# Altium schematic sheet IC2.SchDoc
size A4; SheetNumber: 5; SheetTotal: 5
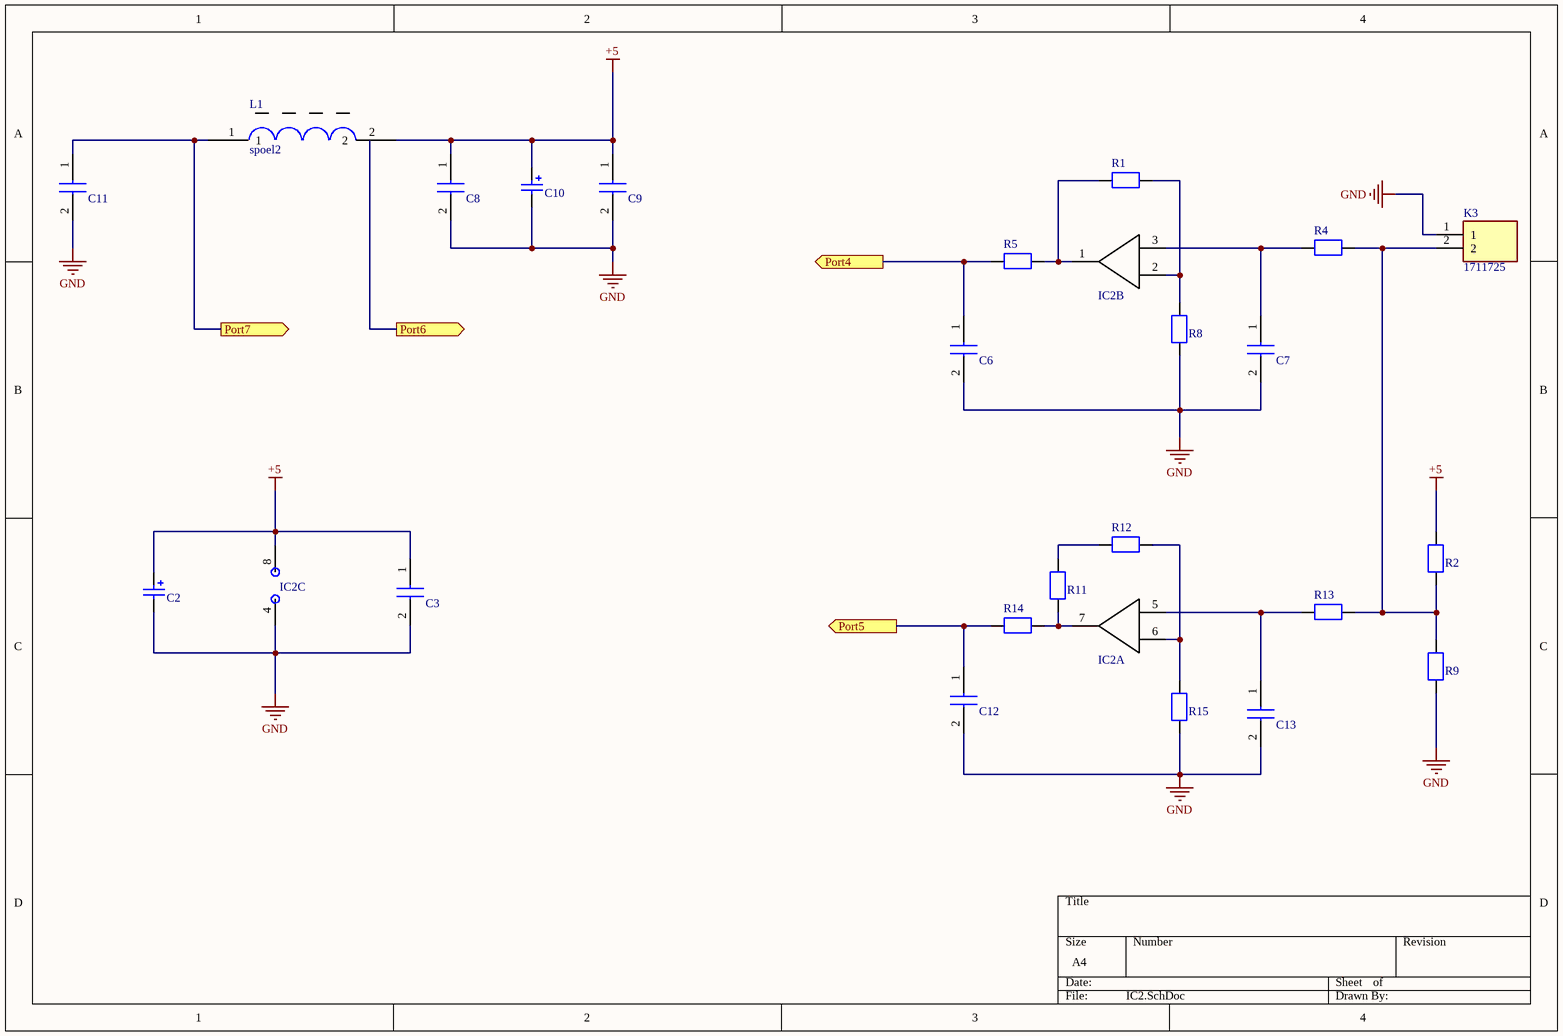
[diagram p0: IC2.SchDoc]

## Parts
C2  10uF  [WCAP-ATG8_D5H11]  (value not drawn)
C3  08055A130JAT2A  [CAPC2012X94N]  (value not drawn)
C6  08055A130JAT2A  [CAPC2012X94N]  (value not drawn)
C7  08055A130JAT2A  [CAPC2012X94N]  (value not drawn)
C8  08055A130JAT2A  [CAPC2012X94N]  (value not drawn)
C9  08055A130JAT2A  [CAPC2012X94N]  (value not drawn)
C10  10uF  [WCAP-ATG8_D5H11]  (value not drawn)
C11  08055A130JAT2A  [CAPC2012X94N]  (value not drawn)
C12  08055A130JAT2A  [CAPC2012X94N]  (value not drawn)
C13  08055A130JAT2A  [CAPC2012X94N]  (value not drawn)
IC2  MCP6002-E_P  [DIP781W56P254L950H533Q8N]  (value not drawn)  (parts A,B,C of 3)
K3  1711725  [1711725]
L1  spoel2  [INDC3225X270N]
R1  CRCW08050000Z0EA  [RESC2013X50X30LL20T20]  (value not drawn)
R2  CRCW08050000Z0EA  [RESC2013X50X30LL20T20]  (value not drawn)
R4  CRCW08050000Z0EA  [RESC2013X50X30LL20T20]  (value not drawn)
R5  CRCW08050000Z0EA  [RESC2013X50X30LL20T20]  (value not drawn)
R8  CRCW08050000Z0EA  [RESC2013X50X30LL20T20]  (value not drawn)
R9  CRCW08050000Z0EA  [RESC2013X50X30LL20T20]  (value not drawn)
R11  CRCW08050000Z0EA  [RESC2013X50X30LL20T20]  (value not drawn)
R12  CRCW08050000Z0EA  [RESC2013X50X30LL20T20]  (value not drawn)
R13  CRCW08050000Z0EA  [RESC2013X50X30LL20T20]  (value not drawn)
R14  CRCW08050000Z0EA  [RESC2013X50X30LL20T20]  (value not drawn)
R15  CRCW08050000Z0EA  [RESC2013X50X30LL20T20]  (value not drawn)

## Ports
Port4 (out), Port5 (out), Port6 (out), Port7 (out)

## Nets
+5: C2.1(P) C3.1 C8.1 C9.1 C10.1(P) L1.2 R2.2
GND: C2.2(N) C3.2 C6.2 C7.2 C8.2 C9.2 C10.2(N) C11.2 C12.2 C13.2 K3.1 R8.1 R9.1 R15.1
Port4: C6.1 R5.1 ; port Port4
Port5: C12.1 R14.1 ; port Port5
Port7: C11.1 L1.1 ; port Port7
NetC7_1: C7.1 IC2.3(VINA+) R4.1
NetC13_1: C13.1 IC2.5(VINB+) R13.1
NetIC2_1: IC2.1(VOUTA) R1.1 R5.2
NetIC2_2: IC2.2(VINA-) R1.2 R8.2
NetIC2_6: IC2.6(VINB-) R12.2 R15.2
NetIC2_7: IC2.7(VOUTB) R11.1 R14.2
NetK3_2: K3.2 R2.1 R4.2 R9.2 R13.2
NetR11_2: R11.2 R12.1

Not connected (* = marked no-connect by the designer): IC2 4(VSS) 8(VDD)

## Library data of the parts
C2 C10 = 860010672009: WCAP-ATG8 Aluminum Electrolytic Capacitor, Radial THT, D5xH11mm, 10uF, 50V; Manufacturer: Wurth Elektronik; Capacitance Tolerance: +/-20%; Dissipation Factor: 10%; Endurance: 2000h; Leakage Current: 5uA; Ripple Current: 72mA; Technical Reference: ATBC110100M050DSPA3B000; ComponentLink1Description: Manufacturer Link; ComponentLink1URL: https://www.we-online.com/redexpert/article/860010672009?ad; ComponentLink2Description: Datasheet; ComponentLink2URL: https://www.we-online.com/redexpert/spec/860010672009?ad; Category: Aluminum Electrolytic Capacitors; Match Code: WCAP-ATG8; Manufacturer Part Number: 860010672009; Mount: Through Hole; Operating Temperature Max: 85°C; Operating Temperature Min: -40°C; Packaging: Ammo Pack; Height: 11mm; Diameter: 5mm; Capacitance: 10uF; Rated Voltage (DC): 50V
C3 C6-C9 C11-C13 = 08055A130JAT2A: Capacitor; Manufacturer_Name: AVX; Datasheet Link: https://componentsearchengine.com/Datasheets/1/06031A100FAT2A.pdf; Height: 0.94mm; Manufacturer_Part_Number: 08055A130JAT2A; Mouser Part Number: 581-08055A130JAT2A; Mouser Price/Stock: https://www.mouser.com/Search/Refine.aspx?Keyword=581-08055A130JAT2A
IC2 = MCP6002-E_P: Integrated Circuit; Manufacturer_Name: Microchip; Manufacturer_Part_Number: MCP6002-E/P; Datasheet Link: http://componentsearchengine.com/Datasheets/3/MCP6002-E_P.pdf; Height: 5.334mm; Mouser Part Number: 579-MCP6002-E/P; Mouser Price/Stock: https://www.mouser.co.uk/ProductDetail/Microchip-Technology/MCP6002-E-P?qs=hul3WK2zl4pqRWzdnAsu%2FQ%3D%3D; Arrow Part Number: MCP6002-E/P; Arrow Price/Stock: https://www.arrow.com/en/products/mcp6002-ep/microchip-technology?region=nac
K3 = 1711725: Connector; Manufacturer_Name: Phoenix Contact; Datasheet Link: http://www.phoenixcontact.com/de/produkte/1711725/pdf; Height: 18.2mm; Manufacturer_Part_Number: 1711725; Mouser Part Number: 651-1711725; Mouser Price/Stock: https://www.mouser.co.uk/ProductDetail/Phoenix-Contact/1711725?qs=F79NelsxgYFLEb9U5DotcA%3D%3D; Arrow Part Number: 1711725; Arrow Price/Stock: https://www.arrow.com/en/products/1711725/phoenix-contact?region=nac
R1 R2 R4 R5 R8 R9 R11-R15 = resistor: Manufacturer: Vishay Dale; Part Number: CRCW08050000Z0EA